# Altium schematic sheet APP_1_Overview.SchDoc: Overview
size Tabloid; DocumentNumber: 2; SheetNumber: 2; SheetTotal: 14; Sheet_Name: Overview; Size: 11x17
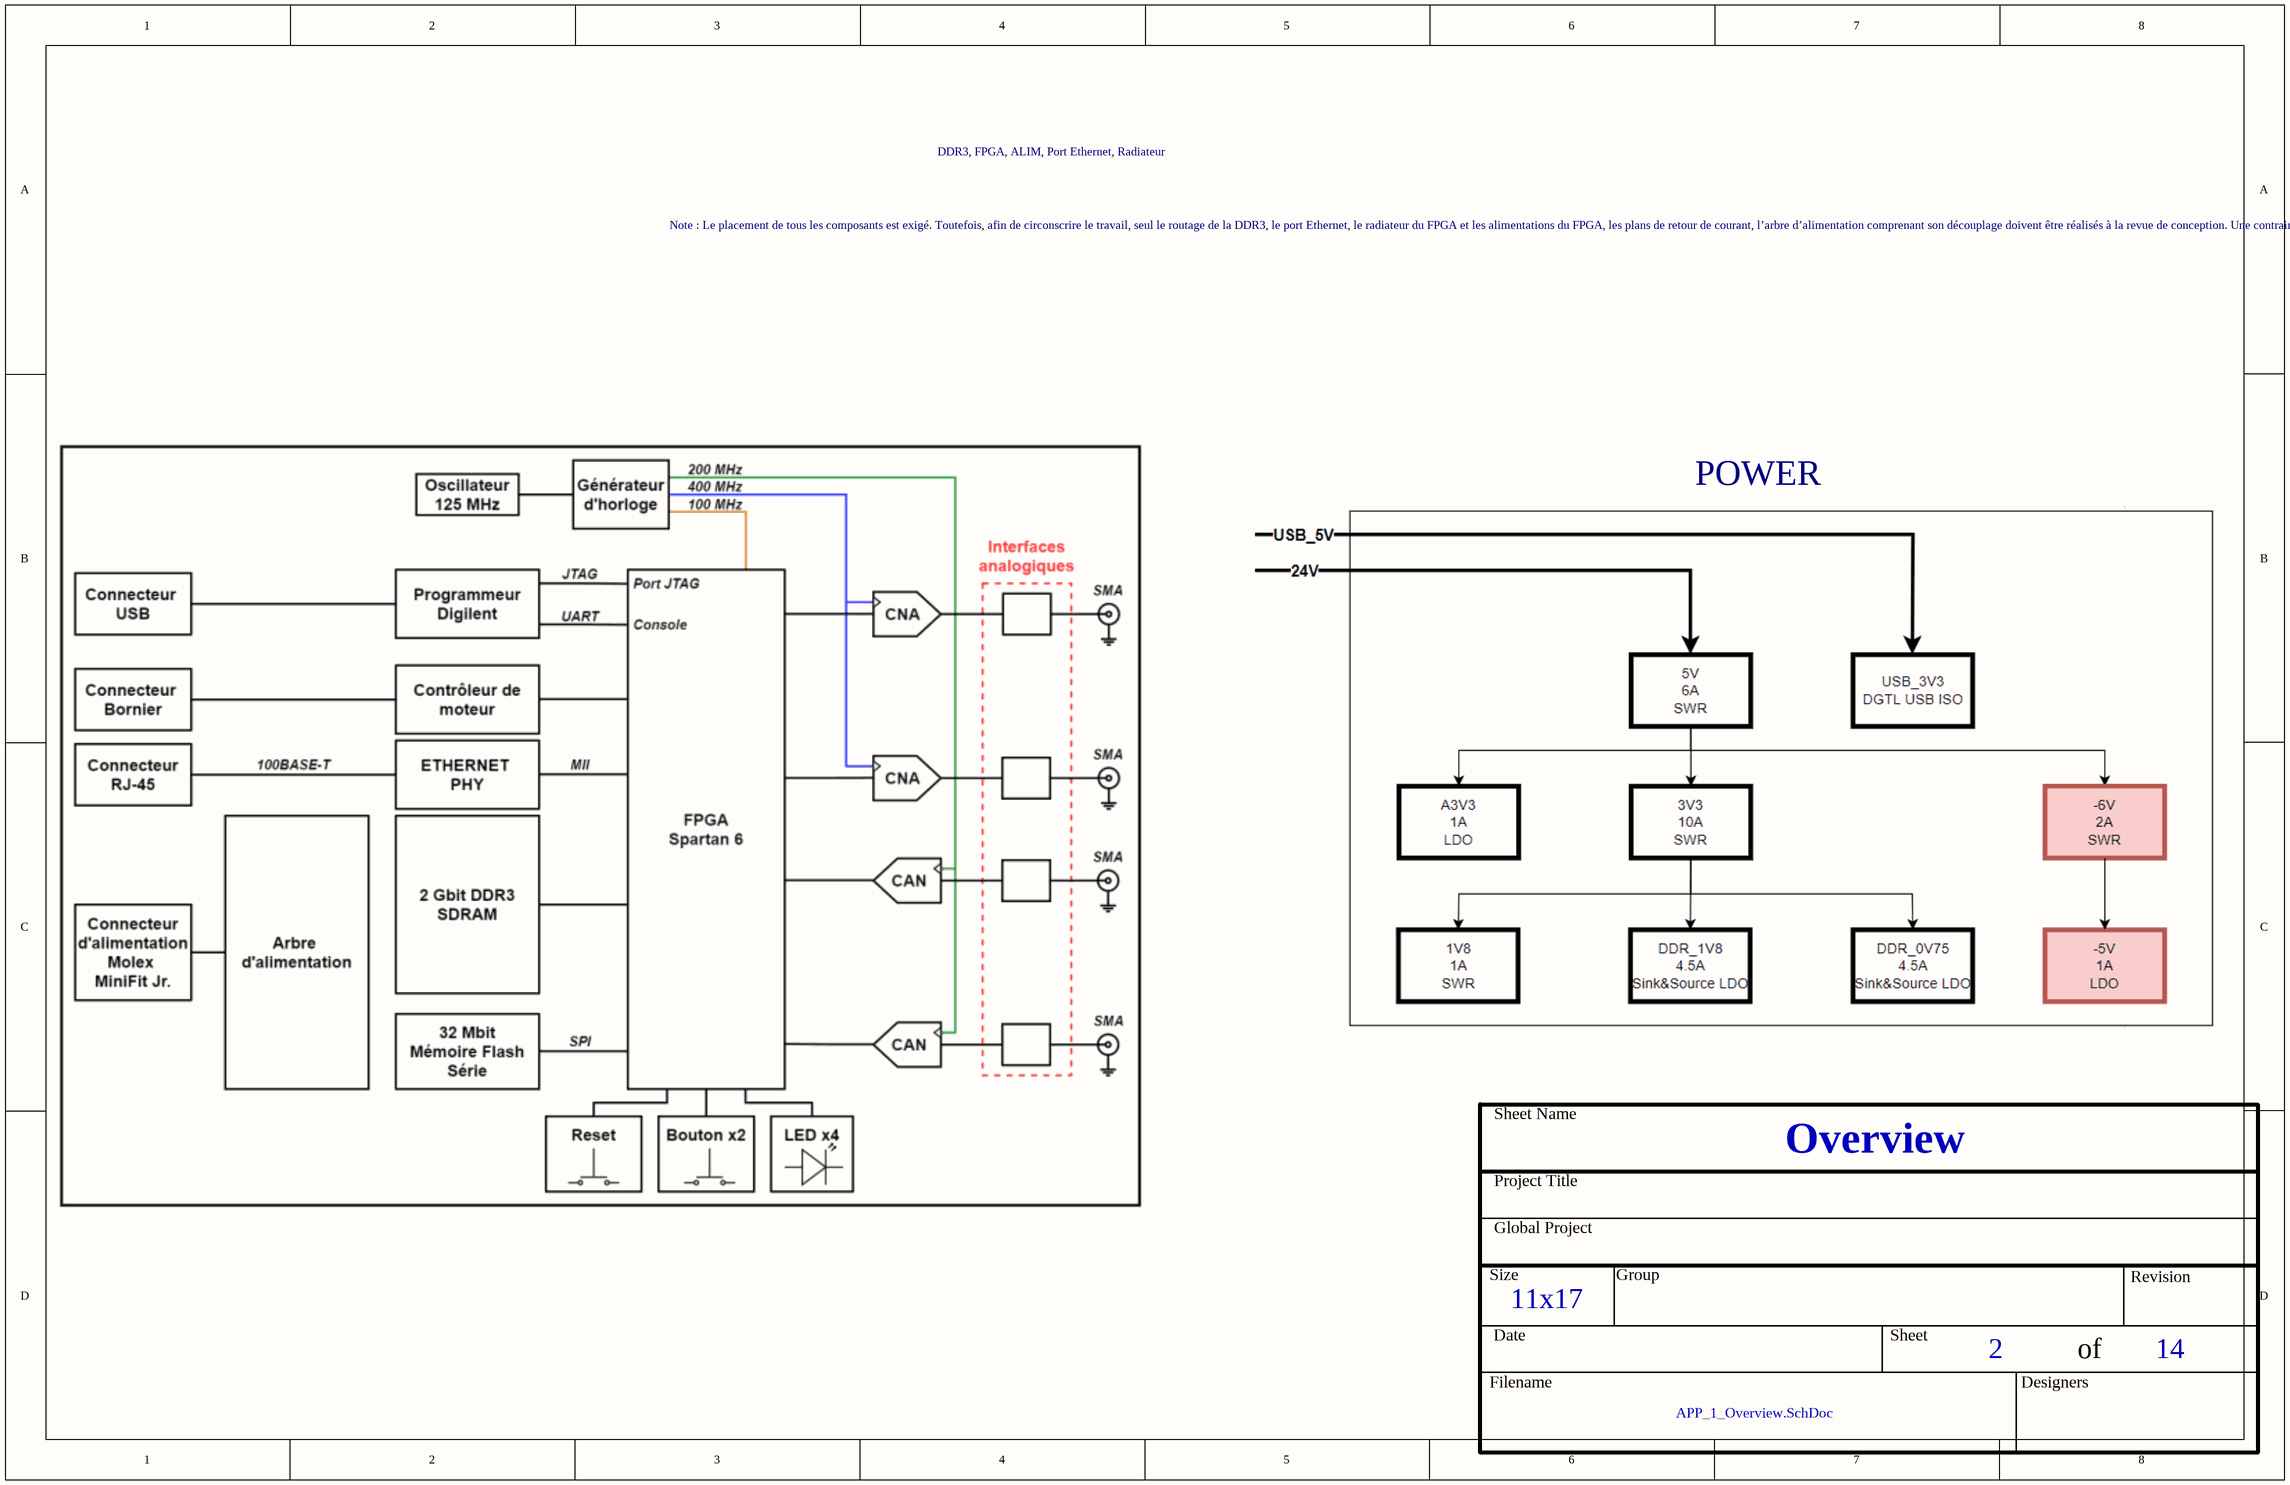
[diagram p0: APP_1_Overview.SchDoc]

## Notes on the sheet
- DDR3, FPGA, ALIM, Port Ethernet, Radiateur
- Note : Le placement de tous les composants est exigé. Toutefois, afin de circonscrire le travail, seul le routage de la DDR3, le port Ethernet, le radiateur du FPGA et les alimentations du FPGA, les plans de retour de courant, l’arbre d’alimentation comprenant son découplage doivent être réalisés à la revue de conception. Une contrainte est exigée pour le routage entre le FPGA et la DDR3 où on exige une distance de 2 cm entre les 2 composants. Il faut spécifier, sans router les traces (épaisseurs, largeur, vias etc…) du contrôleur de moteur jusqu’au connecteur. L’équipe doit fournir un mini rapport de 1 page expliquant les choix technologiques pour l’empilement (stack-up), les matériaux et les épaisseurs de cuivre. Cette page correspond à votre travail en tant qu’ingénieur de conception.
- POWER
- Sheet Name
- Project Title
- Global Project
- Size
- Group
- Revision
- Date
- Sheet
- of
- Filename
- Designers